# Altium schematic sheet SPEC_A7_SoM.SchDoc
size 420 x 297 mm; DrawnBy: A.B.; Organization: Wydział Elektroniki i Technik Informacyjnych; Address1: ul. Nowowiejska 15/19; Address2: 00-665 Warszawa; Address3: NSW; Address4: Polska; Revision: 0; SheetNumber: 5; SheetTotal: 5; CreateDate: 20/06/2024; Designer: A.B.; Projet: Spec7; CheckedDate: -; ModifiedBy: -
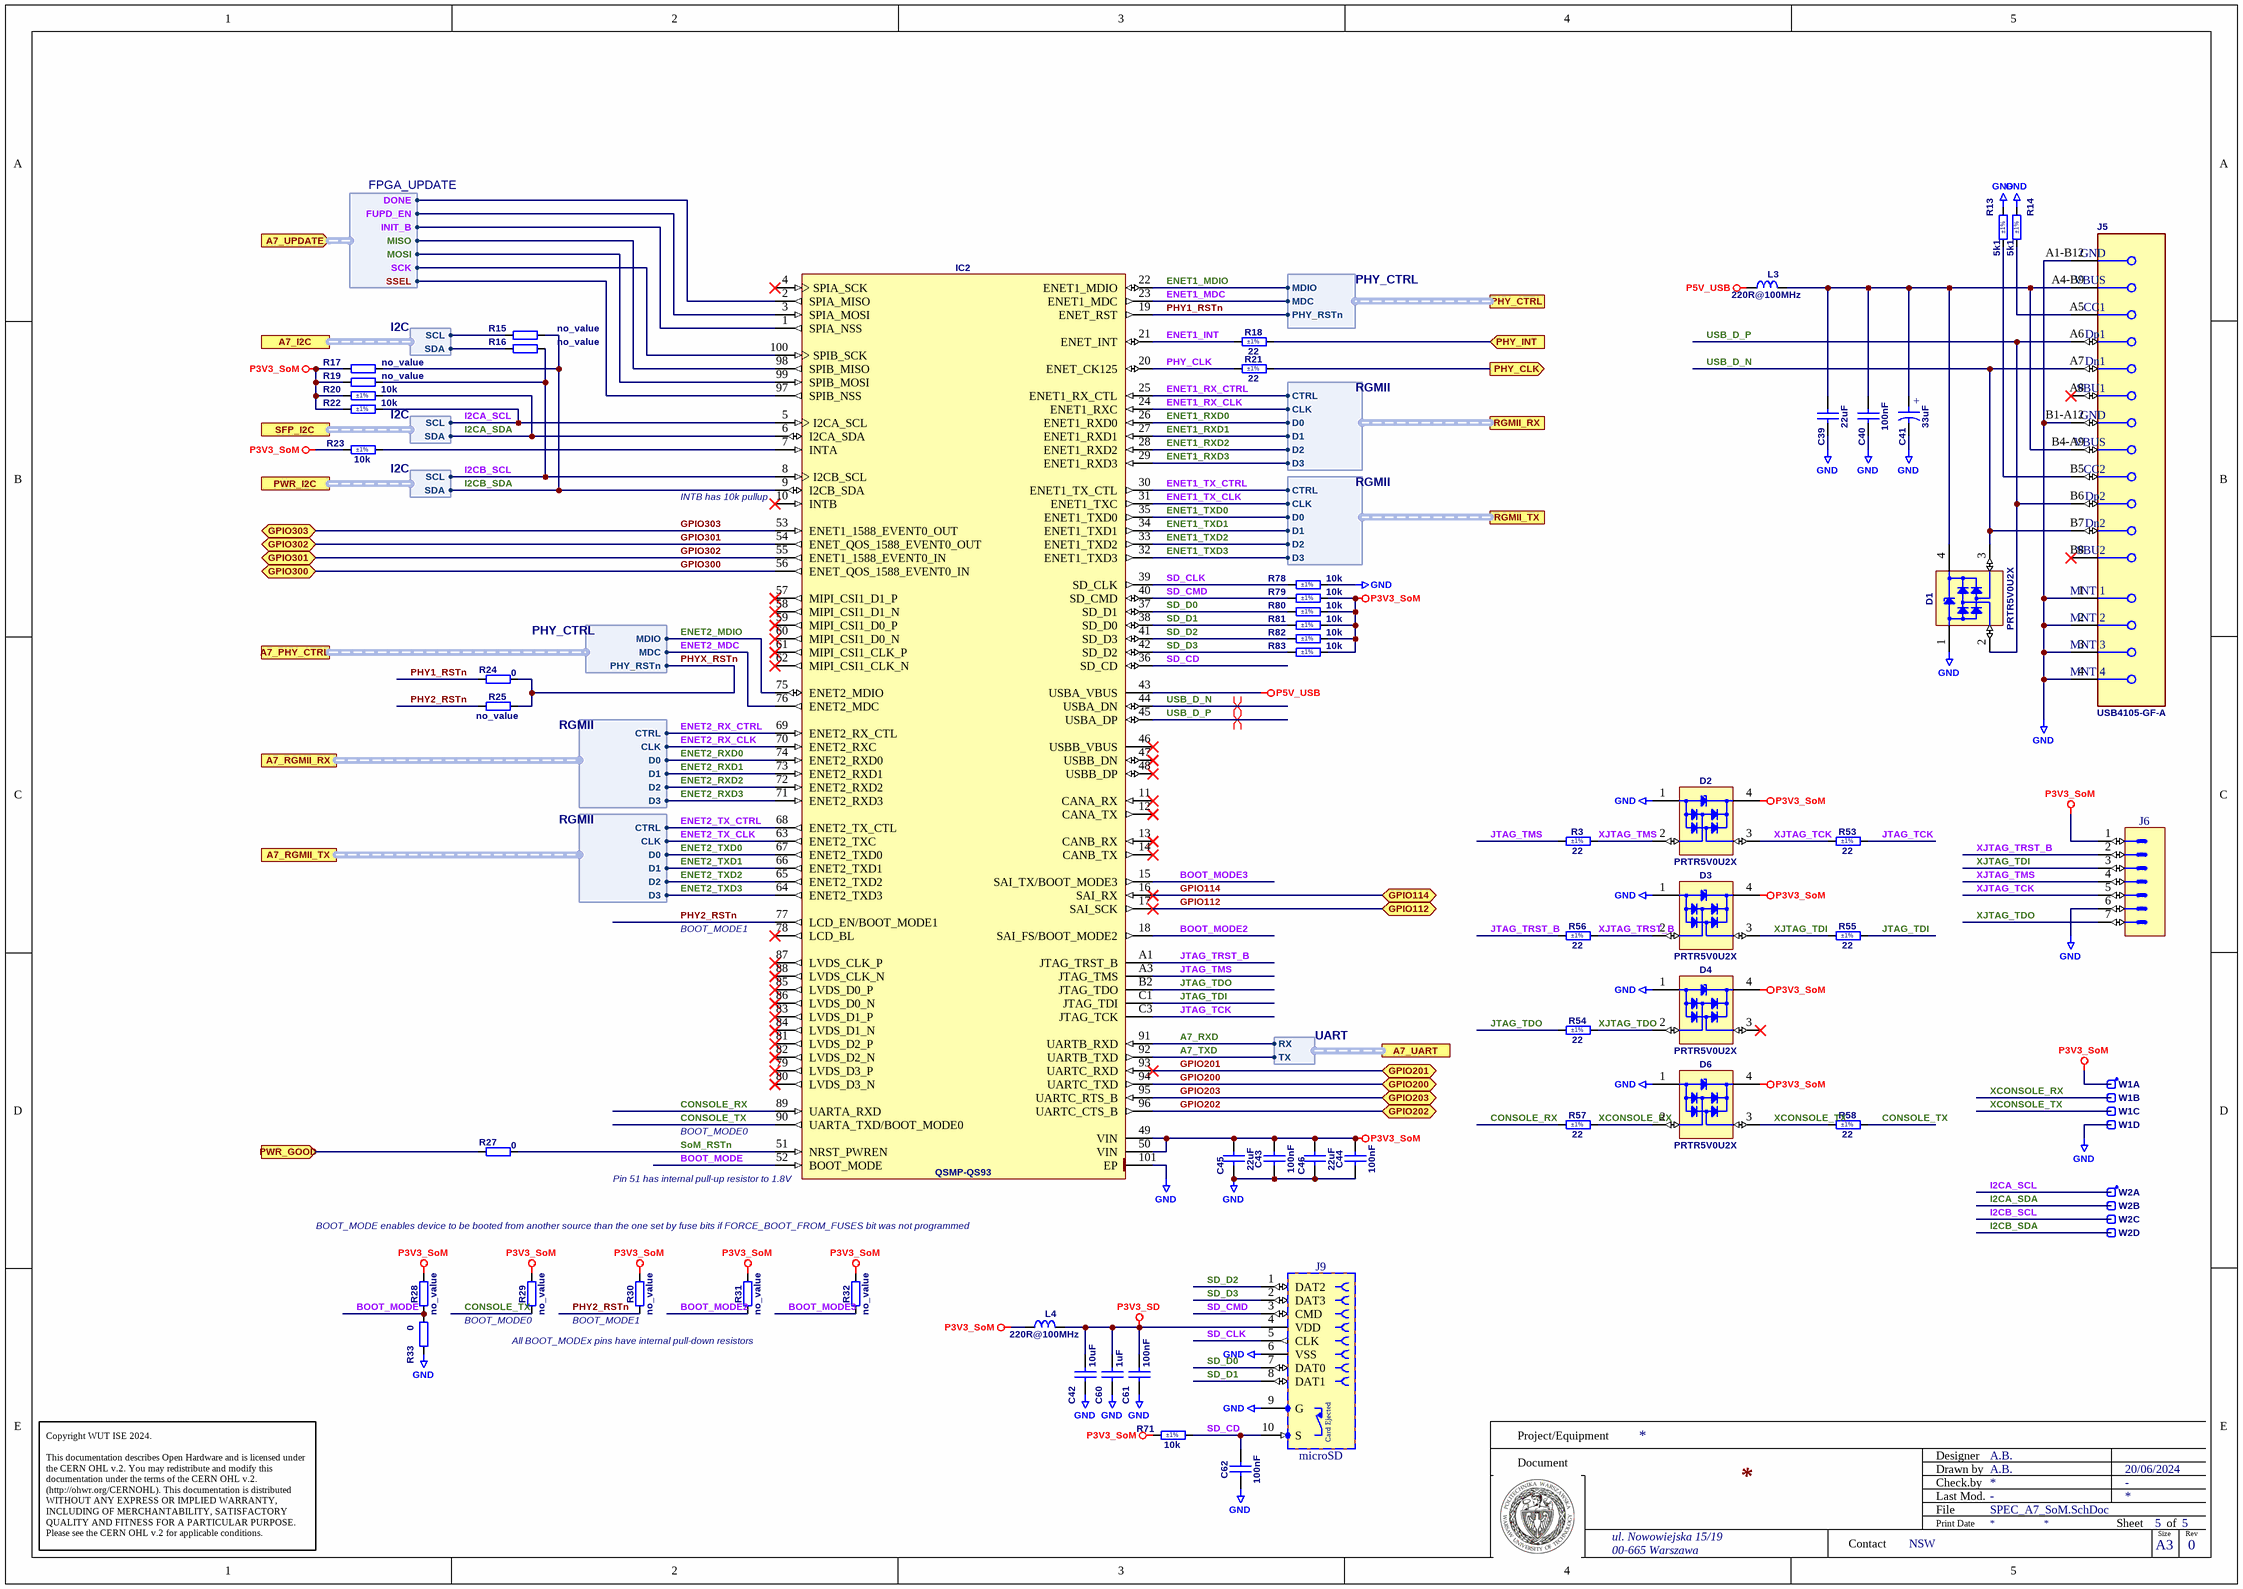
[diagram p0: SPEC_A7_SoM.SchDoc]

## Parts
C39  22uF  [CAPC2012X135N]
C40  100nF  [CAPC1005X55N]
C41  33uF  [CAPMP3528X210N]
C42  10uF  [CAPC1608X80N]
C43  100nF  [CAPC1005X55N]
C44  100nF  [CAPC1005X55N]
C45  22uF  [CAPC2012X135N]
C46  22uF  [CAPC2012X135N]
C60  1uF  [CAPC1005X55N]
C61  100nF  [CAPC1005X55N]
C62  100nF  [CAPC1005X55N]
D1  PRTR5V0U2X  [SOT190P230X110-4N]
D2  PRTR5V0U2X  [SOT190P230X110-4N]
D3  PRTR5V0U2X  [SOT190P230X110-4N]
D4  PRTR5V0U2X  [SOT190P230X110-4N]
D6  PRTR5V0U2X  [SOT190P230X110-4N]
IC2  QSMP-QS93  [KARO_QSMP-1530]
J5  USB4105-GF-A  [FP-USB4105-GF-A-MFG]
J6  Header 7  [SAMTEC_TSW-107-07-L-S-LL]  (value not drawn)
J9  microSD  [ATTEND_112A-TAAR-R03]
L3  220R@100MHz  [INDC2012X105N]
L4  220R@100MHz  [INDC2012X105N]
R3  22  Tolerance: ±1%  [RESC1005X40N]
R13  5k1  Tolerance: ±1%  [RESC1005X40N]
R14  5k1  Tolerance: ±1%  [RESC1005X40N]
R15  no_value  [RESC1005X40N]  (no BOM)
R16  no_value  [RESC1005X40N]  (no BOM)
R17  no_value  [RESC1005X40N]  (no BOM)
R18  22  Tolerance: ±1%  [RESC1005X40N]
R19  no_value  [RESC1005X40N]  (no BOM)
R20  10k  Tolerance: ±1%  [RESC1005X40N]
R21  22  Tolerance: ±1%  [RESC1005X40N]
R22  10k  Tolerance: ±1%  [RESC1005X40N]
R23  10k  Tolerance: ±1%  [RESC1005X40N]
R24  0  [RESC1005X40N]
R25  no_value  [RESC1005X40N]  (no BOM)
R27  0  [RESC1005X40N]
R28  no_value  [RESC1005X40N]  (no BOM)
R29  no_value  [RESC1005X40N]  (no BOM)
R30  no_value  [RESC1005X40N]  (no BOM)
R31  no_value  [RESC1005X40N]  (no BOM)
R32  no_value  [RESC1005X40N]  (no BOM)
R33  0  [RESC1005X40N]
R53  22  Tolerance: ±1%  [RESC1005X40N]
R54  22  Tolerance: ±1%  [RESC1005X40N]
R55  22  Tolerance: ±1%  [RESC1005X40N]
R56  22  Tolerance: ±1%  [RESC1005X40N]
R57  22  Tolerance: ±1%  [RESC1005X40N]
R58  22  Tolerance: ±1%  [RESC1005X40N]
R71  10k  Tolerance: ±1%  [RESC1005X40N]
R78  10k  Tolerance: ±1%  [RESC1005X40N]
R79  10k  Tolerance: ±1%  [RESC1005X40N]
R80  10k  Tolerance: ±1%  [RESC1005X40N]
R81  10k  Tolerance: ±1%  [RESC1005X40N]
R82  10k  Tolerance: ±1%  [RESC1005X40N]
R83  10k  Tolerance: ±1%  [RESC1005X40N]
W1  Header 4  [SAMTEC_HTSW-104-23-L-S]  (value not drawn)  (parts A,B,C,D of 4)
W2  Header 4  [SAMTEC_HTSW-104-23-L-S]  (value not drawn)  (parts A,B,C,D of 4)

## Ports
A7_I2C (harness I2C), A7_PHY_CTRL (harness PHY_CTRL), A7_RGMII_RX (harness RGMII), A7_RGMII_TX (harness RGMII), A7_UART (harness UART), A7_UPDATE (in, harness FPGA_UPDATE), GPIO112 (bidir), GPIO114 (bidir), GPIO200 (bidir), GPIO201 (bidir), GPIO202 (bidir), GPIO203 (bidir), GPIO300 (bidir), GPIO301 (bidir), GPIO302 (bidir), GPIO303 (bidir), PHY_CLK (out), PHY_CTRL (harness PHY_CTRL), PHY_INT (in), PWR_GOOD (in), PWR_I2C (harness I2C), RGMII_RX (harness RGMII), RGMII_TX (harness RGMII), SFP_I2C (harness I2C)

## Harnesses
RGMII: CTRL, CLK, D0, D1, D2, D3
PHY_CTRL: MDIO, MDC, PHY_RSTn
I2C: SCL, SDA
UART: RX, TX
FPGA_UPDATE: DONE, FUPD_EN, INIT_B, MISO, MOSI, SCK, SSEL

## Nets
GND: C39.1 C40.1 C41.2 C42.1 C43.1 C44.1 C45.1 C46.1 C60.1 C61.1 C62.1 D1.1(GND) D2.1(GND) D3.1(GND) D4.1(GND) D6.1(GND) IC2.101(EP) J5.1(MNT_1) J5.2(MNT_2) J5.3(MNT_3) J5.4(MNT_4) J5.A1-B12(GND) J5.B1-A12(GND) J6.6 J9.6(VSS) J9.9(G) R13.2 R14.2 R33.1 R78.2 W1.4
P3V3_SD: C42.2 C60.2 C61.2 J9.4(VDD) L4.2
P3V3_SoM: C43.2 C44.2 C45.2 C46.2 D2.4(VCC) D3.4(VCC) D4.4(VCC) D6.4(VCC) IC2.49(VIN) IC2.50(VIN) J6.1 L4.1 R17.1 R19.1 R20.1 R22.1 R23.1 R28.2 R29.2 R30.2 R31.2 R32.2 R71.1 R79.2 R80.2 R81.2 R82.2 R83.2 W1.1
P5V_USB: IC2.43(USBA_VBUS) L3.1
A7_RXD: IC2.91(UARTB_RXD) ; port A7_UART.RX
A7_TXD: IC2.92(UARTB_TXD) ; port A7_UART.TX
BOOT_MODE: IC2.52(BOOT_MODE) R28.1 R33.2
BOOT_MODE2: IC2.18(SAI_FS/BOOT_MODE2) R31.1
BOOT_MODE3: IC2.15(SAI_TX/BOOT_MODE3) R32.1
CONSOLE_RX: IC2.89(UARTA_RXD) R57.1
CONSOLE_TX: IC2.90(UARTA_TXD/BOOT_MODE0) R29.1 R58.2
ENET1_INT: IC2.21(ENET_INT) R18.1
ENET1_MDC: IC2.23(ENET1_MDC) ; port PHY_CTRL.MDC
ENET1_MDIO: IC2.22(ENET1_MDIO) ; port PHY_CTRL.MDIO
ENET1_RX_CLK: IC2.24(ENET1_RXC) ; port RGMII_RX.CLK
ENET1_RX_CTRL: IC2.25(ENET1_RX_CTL) ; port RGMII_RX.CTRL
ENET1_RXD0: IC2.26(ENET1_RXD0) ; port RGMII_RX.D0
ENET1_RXD1: IC2.27(ENET1_RXD1) ; port RGMII_RX.D1
ENET1_RXD2: IC2.28(ENET1_RXD2) ; port RGMII_RX.D2
ENET1_RXD3: IC2.29(ENET1_RXD3) ; port RGMII_RX.D3
ENET1_TX_CLK: IC2.31(ENET1_TXC) ; port RGMII_TX.CLK
ENET1_TX_CTRL: IC2.30(ENET1_TX_CTL) ; port RGMII_TX.CTRL
ENET1_TXD0: IC2.35(ENET1_TXD0) ; port RGMII_TX.D0
ENET1_TXD1: IC2.34(ENET1_TXD1) ; port RGMII_TX.D1
ENET1_TXD2: IC2.33(ENET1_TXD2) ; port RGMII_TX.D2
ENET1_TXD3: IC2.32(ENET1_TXD3) ; port RGMII_TX.D3
ENET2_MDC: IC2.76(ENET2_MDC) ; port A7_PHY_CTRL.MDC
ENET2_MDIO: IC2.75(ENET2_MDIO) ; port A7_PHY_CTRL.MDIO
ENET2_RX_CLK: IC2.70(ENET2_RXC) ; port A7_RGMII_RX.CLK
ENET2_RX_CTRL: IC2.69(ENET2_RX_CTL) ; port A7_RGMII_RX.CTRL
ENET2_RXD0: IC2.74(ENET2_RXD0) ; port A7_RGMII_RX.D0
ENET2_RXD1: IC2.73(ENET2_RXD1) ; port A7_RGMII_RX.D1
ENET2_RXD2: IC2.72(ENET2_RXD2) ; port A7_RGMII_RX.D2
ENET2_RXD3: IC2.71(ENET2_RXD3) ; port A7_RGMII_RX.D3
ENET2_TX_CLK: IC2.63(ENET2_TXC) ; port A7_RGMII_TX.CLK
ENET2_TX_CTRL: IC2.68(ENET2_TX_CTL) ; port A7_RGMII_TX.CTRL
ENET2_TXD0: IC2.67(ENET2_TXD0) ; port A7_RGMII_TX.D0
ENET2_TXD1: IC2.66(ENET2_TXD1) ; port A7_RGMII_TX.D1
ENET2_TXD2: IC2.65(ENET2_TXD2) ; port A7_RGMII_TX.D2
ENET2_TXD3: IC2.64(ENET2_TXD3) ; port A7_RGMII_TX.D3
GPIO112: IC2.17(SAI_SCK) ; port GPIO112
GPIO114: IC2.16(SAI_RX) ; port GPIO114
GPIO200: IC2.94(UARTC_TXD) ; port GPIO200
GPIO201: IC2.93(UARTC_RXD) ; port GPIO201
GPIO202: IC2.96(UARTC_CTS_B) ; port GPIO202
GPIO203: IC2.95(UARTC_RTS_B) ; port GPIO203
GPIO300: IC2.56(ENET_QOS_1588_EVENT0_IN) ; port GPIO300
GPIO301: IC2.54(ENET_QOS_1588_EVENT0_OUT) ; port GPIO302
GPIO302: IC2.55(ENET1_1588_EVENT0_IN) ; port GPIO301
GPIO303: IC2.53(ENET1_1588_EVENT0_OUT) ; port GPIO303
I2CA_SCL: IC2.5(I2CA_SCL) R22.2 W2.1 ; port SFP_I2C.SCL
I2CA_SDA: IC2.6(I2CA_SDA) R20.2 W2.2 ; port SFP_I2C.SDA
I2CB_SCL: IC2.8(I2CB_SCL) R16.2 R19.2 W2.3 ; port PWR_I2C.SCL
I2CB_SDA: IC2.9(I2CB_SDA) R15.2 R17.2 W2.4 ; port PWR_I2C.SDA
JTAG_TCK: IC2.C3(JTAG_TCK) R53.2
JTAG_TDI: IC2.C1(JTAG_TDI) R55.2
JTAG_TDO: IC2.B2(JTAG_TDO) R54.1
JTAG_TMS: IC2.A3(JTAG_TMS) R3.1
JTAG_TRST_B: IC2.A1(JTAG_TRST_B) R56.1
PHY1_RSTn: IC2.19(ENET_RST) R24.1 ; port PHY_CTRL.PHY_RSTn
PHY2_RSTn: IC2.77(LCD_EN/BOOT_MODE1) R25.1 R30.1
PHY_CLK: IC2.20(ENET_CK125) R21.1
PHY_CLK: R21.2 ; port PHY_CLK  [a separate net that carries the same name]
PHY_INT: R18.2 ; port PHY_INT
PHYX_RSTn: R24.2 R25.2 ; port A7_PHY_CTRL.PHY_RSTn
PWR_GOOD: R27.1 ; port PWR_GOOD
SD_CD: C62.2 IC2.36(SD_CD) J9.10(S) R71.2
SD_CLK: IC2.39(SD_CLK) J9.5(CLK) R78.1
SD_CMD: IC2.40(SD_CMD) J9.3(CMD) R79.1
SD_D0: IC2.37(SD_D1) J9.7(DAT0) R80.1
SD_D1: IC2.38(SD_D0) J9.8(DAT1) R81.1
SD_D2: IC2.41(SD_D3) J9.1(DAT2) R82.1
SD_D3: IC2.42(SD_D2) J9.2(DAT3) R83.1
SoM_RSTn: IC2.51(NRST_PWREN) R27.2
USB_D_N: D1.3(I/O2) IC2.44(USBA_DN) J5.A7(Dn1) J5.B7(Dn2)
USB_D_P: D1.2(I/O1) IC2.45(USBA_DP) J5.A6(Dp1) J5.B6(Dp2)
XCONSOLE_RX: D6.2(I/O1) R57.2 W1.2
XCONSOLE_TX: D6.3(I/O2) R58.1 W1.3
XJTAG_TCK: D2.3(I/O2) J6.5 R53.1
XJTAG_TDI: D3.3(I/O2) J6.3 R55.1
XJTAG_TDO: D4.2(I/O1) J6.7 R54.2
XJTAG_TMS: D2.2(I/O1) J6.4 R3.2
XJTAG_TRST_B: D3.2(I/O1) J6.2 R56.2
NetC39_2: C39.2 C40.2 C41.1 D1.4(VCC) J5.A4-B9(VBUS) J5.B4-A9(VBUS) L3.2
NetIC2_1: IC2.1(SPIA_NSS) ; port A7_UPDATE.INIT_B
NetIC2_2: IC2.2(SPIA_MISO) ; port A7_UPDATE.DONE
NetIC2_3: IC2.3(SPIA_MOSI) ; port A7_UPDATE.FUPD_EN
NetIC2_7: IC2.7(INTA) R23.2
NetIC2_97: IC2.97(SPIB_NSS) ; port A7_UPDATE.SSEL
NetIC2_98: IC2.98(SPIB_MISO) ; port A7_UPDATE.MISO
NetIC2_99: IC2.99(SPIB_MOSI) ; port A7_UPDATE.MOSI
NetIC2_100: IC2.100(SPIB_SCK) ; port A7_UPDATE.SCK
NetJ5_A5: J5.A5(CC1) R14.1
NetJ5_B5: J5.B5(CC2) R13.1
NetR15_1: R15.1 ; port A7_I2C.SCL
NetR16_1: R16.1 ; port A7_I2C.SDA

Not connected (* = marked no-connect by the designer): D4 3(I/O2)*; IC2 4(SPIA_SCK)* 10(INTB)* 11(CANA_RX)* 12(CANA_TX)* 13(CANB_RX)* 14(CANB_TX)* 46(USBB_VBUS)* 47(USBB_DN)* 48(USBB_DP)* 57(MIPI_CSI1_D1_P)* 58(MIPI_CSI1_D1_N)* 59(MIPI_CSI1_D0_P)* 60(MIPI_CSI1_D0_N)* 61(MIPI_CSI1_CLK_P)* 62(MIPI_CSI1_CLK_N)* 78(LCD_BL)* 79(LVDS_D3_P)* 80(LVDS_D3_N)* 81(LVDS_D2_P)* 82(LVDS_D2_N)* 83(LVDS_D1_P)* 84(LVDS_D1_N)* 85(LVDS_D0_P)* 86(LVDS_D0_N)* 87(LVDS_CLK_P)* 88(LVDS_CLK_N)*; J5 A8(SBU1)* B8(SBU2)*

## Layout directives
differential pair: USB_D_N, USB_D_P

## Notes on the sheet
- (near IC2) INTB has 10k pullup
- BOOT_MODE1
- BOOT_MODE0
- (near IC2) Pin 51 has internal pull-up resistor to 1.8V
- BOOT_MODE enables device to be booted from another source than the one set by fuse bits if FORCE_BOOT_FROM_FUSES bit was not programmed
- (near R29) BOOT_MODE0
- All BOOT_MODEx pins have internal pull-down resistors
- (near R30) BOOT_MODE1
- Project/Equipment
- Document
- Designer
- Drawn by
- Check.by
- Copyright WUT ISE 2024.
  This documentation describes Open Hardware and is licensed under the CERN OHL v.2. You may redistribute and modify this documentation under the terms of the CERN OHL v.2. (http://ohwr.org/CERNOHL). This documentation is distributed WITHOUT ANY EXPRESS OR IMPLIED WARRANTY, INCLUDING OF MERCHANTABILITY, SATISFACTORY QUALITY AND FITNESS FOR A PARTICULAR PURPOSE. Please see the CERN OHL v.2 for applicable conditions.
- Contact
- File
- Last Mod.
- Print Date
- Sheet
- Size
- A3
- of
- Rev
- (in symbol ATTEND_112A-TAAR-R03) Card Ejected
- (in symbol CTE3528-21_33UF_16V_10%) +

## Library data of the parts
C39 C45 C46 = CC0805_22UF_16V_10%_X5R: Non-polarised capacitor; Manufacturer: GENERIC; Part Description: SMD Multilayer Chip Ceramic Capacitor; Manufacturer1 Part Number: C2012X5R1C226KT; Tolerance: ±10%; Voltage: 16V; TC: X5R; Manufacturer Part Number: CC0805_22UF_16V_10%_X5R; Part Number: CC0805_22UF_16V_10%_X5R; Value: 22uF; Component Kind: Standard; Component Type: Standard; Pin Count: 2; Status: Preferred; Case: 0805; Mounted: Yes; Socket: No; SMD: Yes; Sense: No; Manufacturer1 Example: TDK; Manufacturer1 ComponentHeight: 1.35mm; HelpURL: \\cern.ch\dfs\Applications\Altium\Datasheets\CC0805_X5R_TDK_C.pdf; Author: CERN DEM JLC; CreateDate: 25.10.2012; LatestRevisionDate: 25.10.2012
C40 C43 C44 C61 C62 = CC0402_100NF_16V_10%_X7R: Non-polarised capacitor; Part Description: SMD Multilayer Chip Ceramic Capacitor; Manufacturer: GENERIC; Manufacturer1 Part Number: GRM155R71C104KA88D; Voltage: 16V; TC: X7R; Tolerance: ±10%; Part Number: CC0402_100NF_16V_10%_X7R; Component Kind: Standard; Component Type: Standard; Pin Count: 2; Value: 100nF; Status: Not Recommended; Manufacturer Part Number: CC0402_100NF_16V_10%_X7R; Case: 0402; Mounted: Yes; Socket: No; SMD: Yes; Sense: No; Manufacturer1 Example: MURATA; Manufacturer1 ComponentHeight: 0.55mm; HelpURL: \\cern.ch\dfs\Applications\Altium\Datasheets\CC0402_X7R_MURATA_GRM.pdf; Author: CERN DEM JLC; CreateDate: 05/12/2013; LatestRevisionDate: 03/12/2007
C41 = CTE3528-21_33UF_16V_10%: Polarised capacitor; Part Description: Solid Tantalum Chip Capacitor; Manufacturer: GENERIC; Manufacturer1 Part Number: TAJB336K016R; Voltage: 16V; Tolerance: ±10%; Part Number: CTE3528-21_33UF_16V_10%; Component Kind: Standard; Component Type: Standard; Pin Count: 2; Value: 33uF; Status: Preferred; Manufacturer Part Number: CTE3528-21_33UF_16V_10%; Case: B; Mounted: Yes; Socket: No; SMD: Yes; Sense: No; HelpURL: \\cern.ch\dfs\Applications\Altium\Datasheets\CTE_AVX_TAJ.pdf; Author: CERN DEM JLC; CreateDate: 03.12.2007; LatestRevisionDate: 03.12.2007; Manufacturer1 Example: AVX; Manufacturer1 ComponentHeight: 2.1mm
C42 = CC0603_10UF_16V_20%_X5R: Non-polarised capacitor; Part Description: SMD Multilayer Chip Ceramic Capacitor; Manufacturer: GENERIC; Manufacturer1 Part Number: GRM188R61C106MA73D; Voltage: 16V; TC: X5R; Tolerance: ±20%; Part Number: CC0603_10UF_16V_20%_X5R; Component Kind: Standard; Component Type: Standard; Pin Count: 2; Value: 10uF; Status: None; Manufacturer Part Number: CC0603_10UF_16V_20%_X5R; Case: 0603; Mounted: Yes; Socket: No; SMD: Yes; Sense: No; Manufacturer1 Example: MURATA; Manufacturer1 ComponentHeight: 0.8mm; HelpURL: \\cern.ch\dfs\Applications\Altium\Datasheets\CC0603_X5R_MURATA_GRM.pdf; Author: CERN DEM MR; CreateDate: 02.03.2016; LatestRevisionDate: 02.03.2016
C60 = CC0402_1UF_16V_10%_X5R: Non-polarised capacitor; Part Description: SMD Multilayer Chip Ceramic Capacitor; Manufacturer: GENERIC; Manufacturer1 Part Number: C1005X5R1C105KT; Voltage: 16V; TC: X5R; Tolerance: ±10%; Part Number: CC0402_1UF_16V_10%_X5R; Component Kind: Standard; Component Type: Standard; Pin Count: 2; Value: 1uF; Status: Preferred; Manufacturer Part Number: CC0402_1UF_16V_10%_X5R; Case: 0402; Mounted: Yes; Socket: No; SMD: Yes; Sense: No; Manufacturer1 Example: TDK; Manufacturer1 ComponentHeight: 0.55mm; HelpURL: \\cern.ch\dfs\Applications\Altium\Datasheets\CC0402_X5R_TDK_C.pdf; Author: CERN DEM JLC; CreateDate: 2012-10-25; LatestRevisionDate: 2012-10-25
D1-D4 D6 = PRTR5V0U2X: Ultra Low Capacitance Double Rail-to-Rail ESD Protection Diode; Part Description: Ultra Low Capacitance (1pF) Double Rail-to-Rail ESD Protection Diode (8kV); Manufacturer: NXP SEMICONDUCTORS; Voltage: 5.5V; PressFit: No; Bonding: No; Part Number: PRTR5V0U2X; Component Kind: Standard; Component Type: Standard; Device: PRTR5V0U2X; PackageDescription: SOT143B, SOT, 1.90mm Pitch; 4 Pin, 1.30mm W X 2.90mm L X 1.10mm H body, IPC Medium Density; Manufacturer Part Number: PRTR5V0U2X; Pin Count: 4; Case: SOT143B; Mounted: Yes; Socket: No; SMD: Yes; Sense: No; ComponentHeight: 1.1mm; HelpURL: \\cern.ch\dfs\Applications\Altium\Datasheets\PRTR5V0U2X.pdf; Author: CERN DEM JLC; CreateDate: 22.03.2011; LatestRevisionDate: 22.03.2011
IC2 = QSMP-QS93: Computer-On-Modules - COM QSMP/QS93; Part Description: Computer-On-Modules - COM QSMP/153A/256S/4GF/E85; Manufacturer: KARO; PressFit: No; Bonding: No; Part Number: QSMP-QS93; Component Kind: Standard; Component Type: Standard; Device: QSMP-QS93; PackageDescription: QFN, 0.65mm Pitch, 100 Pin,27.35mm L X 27.35mm W X 2.3mm H Body (w/Thermal Tab 24.3 X 24.3mm); Status: Not Recommended; Manufacturer Part Number: QSMP-1530; Pin Count: 106; Case: QFP100; Mounted: Yes; Socket: No; SMD: Yes; Sense: No; ComponentHeight: 2.3mm; HelpURL: \\cern.ch\dfs\Applications\Altium\Datasheets\KARO_QSMP-1530.pdf; Author: CERN DEM HF; CreateDate: 22.04.2024; LatestRevisionDate: 22.04.2024
J5 = CMP-245163-000001-1: CONN RCPT USB2.0 TYPEC 5A; Manufacturer: GCT; Voltage Rating: 20V; Is Female: yes; Current Rating: 5/6.25/1.25/0.25A; Number Of Contacts: 16; Conn Orientation: Right Angle; Device Class L1: Connectors; Category: Conn; Lead Free: Yes; RoHS: TRUE; Temperature Range High: +85°C; Digikey Description: CONN RCPT USB2.0 TYPEC 5A; Device Class L3: unset; ComponentLink2Description: Datasheet; Manufacturer Part Number: USB4105-GF-A; Package: 0; Usb Standard: USB 2.0; Device Class L2: USB Connectors; Automotive: No; Temperature Range Low: -40°C; Height: 3.46mm; Temperature: -40°C to +85°C; Contact Material: Gold,Nickel; ComponentLink2URL: https://gct.co/files/drawings/usb4105.pdf; Octopart: https://octopart.com/usb4105-gf-a-gct-106627878
J6 = SAMTEC_TSW-107-07-L-S-LL: Connector 7 Male; Part Description: 7 Contacts, Pitch 2.54mm, Single Row  Through Mount Straigh Header (Post Lead 5.84mm, Tail Lead 2.54mm, Insulator 2.54mm); Manufacturer: SAMTEC; PressFit: No; Part Number: SAMTEC_TSW-107-07-L-S-LL; Component Kind: Standard; Component Type: Standard; Pin Count: 7; Family: Header 7; Mounted: Yes; Socket: No; SMD: No; Sense: No; Status: None; Manufacturer Part Number: TSW-107-07-L-S-LL; ComponentHeight: 8.38mm; HelpURL: \\cern.ch\dfs\Applications\Altium\Datasheets\SAMTEC_TSW-107-07-L-S-LL.pdf; Author: CERN DEM MR; CreateDate: 07.12.2016; LatestRevisionDate: 07.12.2016
J9 = ATTEND_112A-TAAR-R03: Connector MicroSD 8 Pin + Switch; Part Description: MicroSD Socket, Push-Push Type; Manufacturer: ATTEND; PressFit: No; Part Number: ATTEND_112A-TAAR-R03; Component Kind: Standard; Component Type: Standard; Pin Count: 10; Family: microSD; Mounted: Yes; Socket: No; SMD: Yes; Sense: No; Status: None; Manufacturer Part Number: 112A-TAAR-R03; ComponentHeight: 1.9mm; HelpURL: \\cern.ch\dfs\Applications\Altium\Datasheets\ATTEND_112A-TAAR-R03.pdf; Author: CERN DEM JMW; CreateDate: 07.07.2015; LatestRevisionDate: 07.07.2015
L3 L4 = IND0805_MURATA_BLM21PG221SN1D: Inductor; Part Description: SMD EMIFIL Suppression Chip Bead Ferrite; Manufacturer: MURATA; Power: 2A; Resistance: 0.05R; Tolerance: ±25%; Table: Inductors SMD; Part Number: IND0805_MURATA_BLM21PG221SN1D; Component Kind: Standard; Component Type: Standard; Pin Count: 2; Value: 220R@100MHz; Status: None; Manufacturer Part Number: BLM21PG221SN1D; Case: 0805; Mounted: Yes; Socket: No; SMD: Yes; ComponentHeight: 1.05mm; HelpURL: \\cern.ch\dfs\Applications\Altium\Datasheets\IND0402_MURATA_BLM21P.pdf; Author: CERN DEM JLC; CreateDate: 25/01/2010; LatestRevisionDate: 25/01/2010
R3 R18 R21 R53-R58 = R0402_22R_1%_0.0625W_100PPM: Resistor - 1%; Part Description: General Purpose Thick Film Chip Resistor; Manufacturer: GENERIC; Manufacturer1 Part Number: 232270672209L; TC: ±100ppm/°C; PressFit: No; Part Number: R0402_22R_1%_0.0625W_100PPM; Component Kind: Standard; Component Type: Standard; Pin Count: 2; Value: 22; Status: Not Recommended; Power: 0.0625W; Manufacturer Part Number: R0402_22R_1%_0.0625W_100PPM; Case: 0402; Mounted: Yes; Sense: No; Socket: No; SMD: Yes; Manufacturer1 Example: YAGEO PHYCOMP; Manufacturer1 ComponentHeight: 0.4mm; HelpURL: \\cern.ch\dfs\Applications\Altium\Datasheets\R0402_Phycomp_RC0402.pdf; Author: CERN DEM JLC; CreateDate: 03.12.2007; LatestRevisionDate: 17.10.2012
R13 R14 = R0402_5K1_1%_0.0625W_100PPM: Resistor - 1%; Part Description: General Purpose Thick Film Chip Resistor; Manufacturer: GENERIC; Manufacturer1 Part Number: 232270675102L; TC: ±100ppm/°C; PressFit: No; Part Number: R0402_5K1_1%_0.0625W_100PPM; Component Kind: Standard; Component Type: Standard; Pin Count: 2; Value: 5k1; Status: Not Recommended; Power: 0.0625W; Manufacturer Part Number: R0402_5K1_1%_0.0625W_100PPM; Case: 0402; Mounted: Yes; Sense: No; Socket: No; SMD: Yes; Manufacturer1 Example: YAGEO PHYCOMP; Manufacturer1 ComponentHeight: 0.4mm; HelpURL: \\cern.ch\dfs\Applications\Altium\Datasheets\R0402_Phycomp_RC0402.pdf; Author: CERN DEM JLC; CreateDate: 03.12.2007; LatestRevisionDate: 17.10.2012
R15-R17 R19 R24 R25 R27-R33 = R0402_0R_JUMPER: Resistor; Part Description: 1A (0.05R Max DC Resistance) Zero Ohm Jumper; Manufacturer: GENERIC; Manufacturer1 Part Number: 232270591001L; PressFit: No; Part Number: R0402_0R_JUMPER; Component Type: Standard; Pin Count: 2; Status: Not Recommended; Manufacturer Part Number: R0402_0R_JUMPER; Case: 0402; Mounted: Yes; Sense: No; Socket: No; SMD: Yes; Manufacturer1 Example: YAGEO PHYCOMP; Manufacturer1 ComponentHeight: 0.4mm; HelpURL: \\cern.ch\dfs\Applications\Altium\Datasheets\R0402_Phycomp_RC0402.pdf; Author: CERN DEM JLC; CreateDate: 03.12.2007; LatestRevisionDate: 17.10.2012
  R15-R17 R19 R25 R28-R32: Value: no_value
  R24 R27 R33: Component Kind: Standard; Value: 0
R20 R22 R23 R71 R78-R83 = R0402_10K_1%_0.0625W_100PPM: Resistor - 1%; Part Description: General Purpose Thick Film Chip Resistor; Manufacturer: GENERIC; Manufacturer1 Part Number: 232270671003L; TC: ±100ppm/°C; PressFit: No; Part Number: R0402_10K_1%_0.0625W_100PPM; Component Kind: Standard; Component Type: Standard; Pin Count: 2; Value: 10k; Status: Not Recommended; Power: 0.0625W; Manufacturer Part Number: R0402_10K_1%_0.0625W_100PPM; Case: 0402; Mounted: Yes; Sense: No; Socket: No; SMD: Yes; Manufacturer1 Example: YAGEO PHYCOMP; Manufacturer1 ComponentHeight: 0.4mm; HelpURL: \\cern.ch\dfs\Applications\Altium\Datasheets\R0402_Phycomp_RC0402.pdf; Author: CERN DEM JLC; CreateDate: 03.12.2007; LatestRevisionDate: 17.10.2012
W1 W2 = SAMTEC_HTSW-104-23-L-S: 4 Mini Wire-Wrap Contact Strip Header; Part Description: 4 Contacts, Pitch 2.54mm, Single Row  Through Mount Straight Header (Post Lead 5.84mm, Tail Lead 2.92mm, Insulator 2.54mm); Manufacturer: SAMTEC; PressFit: No; Status Comment: High Temperature; Part Number: SAMTEC_HTSW-104-23-L-S; Component Kind: Standard; Component Type: Standard; Pin Count: 4; Family: Header 4; Mounted: Yes; Socket: No; Sense: No; SMD: No; Status: Preferred; Manufacturer Part Number: HTSW-104-23-L-S; ComponentHeight: 8.38mm; HelpURL: \\cern.ch\dfs\Applications\Altium\Datasheets\SAMTEC_HTSW-104-23-L-S.pdf; Author: CERN DEM JLC; CreateDate: 22/02/2018; LatestRevisionDate: 22/02/2018